# Altium schematic sheet 2-LCD&CAMERA.SchDoc: HD-S16-MB-V1.0
size A3
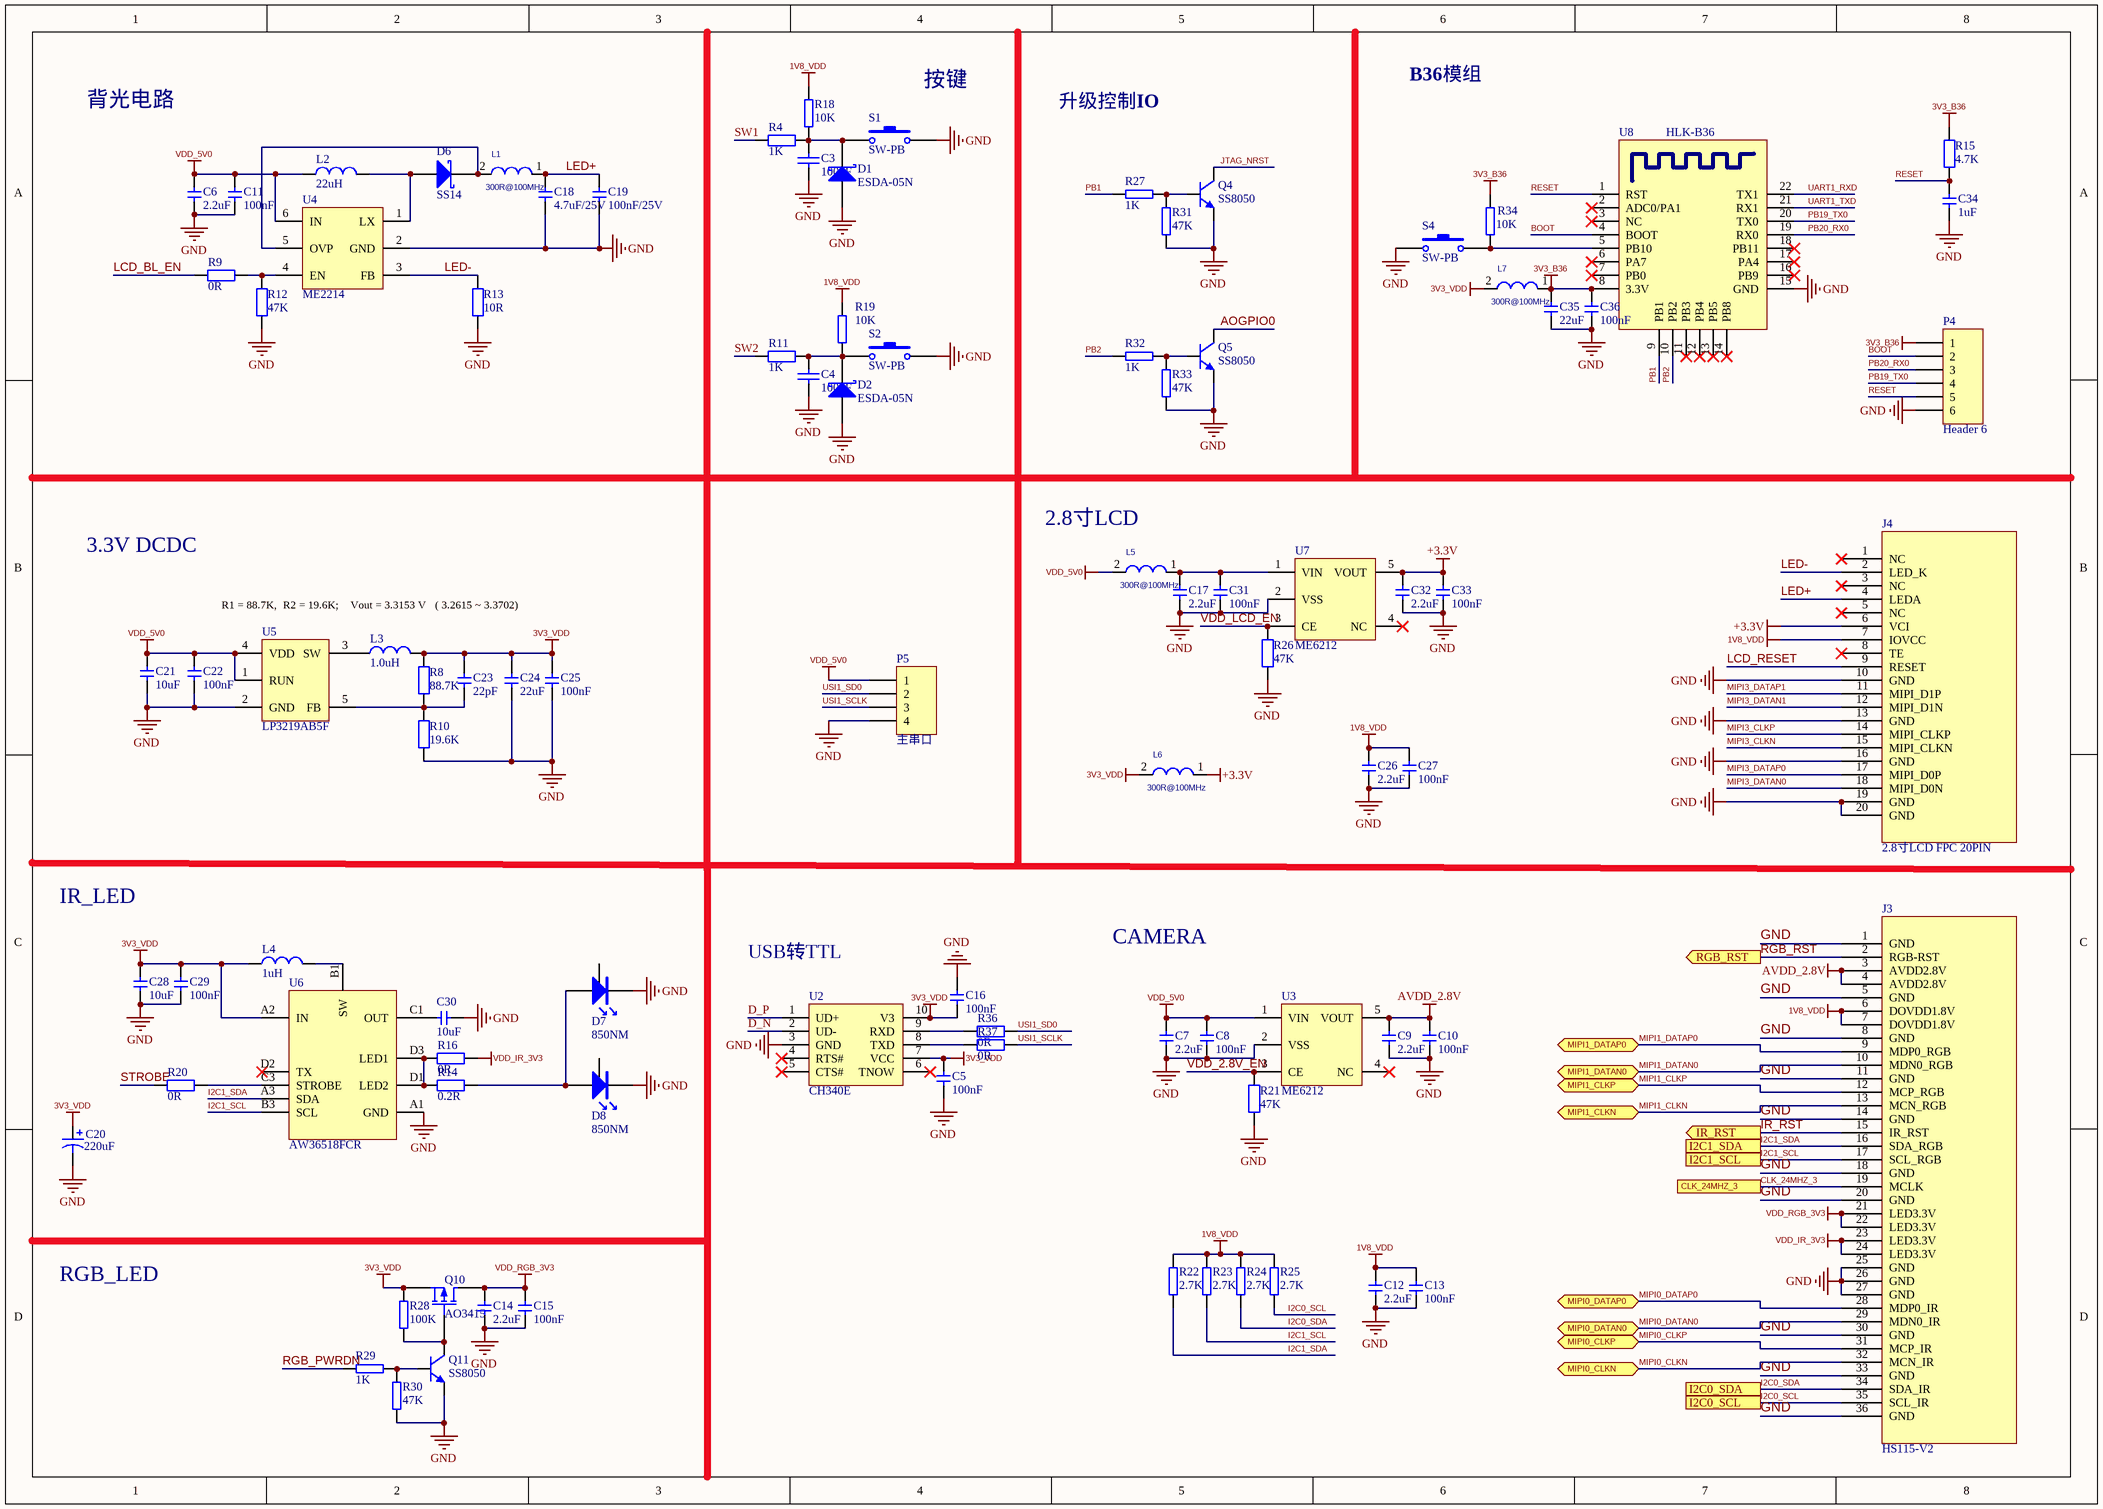
[diagram p0: 2-LCD&CAMERA.SchDoc]

## Parts
C3  100nF  [C0402]
C4  100nF  [C0402]
C5  100nF  [C0402]
C6  2.2uF  [C0402]
C7  2.2uF  [C0402]
C8  100nF  [C0402]
C9  2.2uF  [C0402]
C10  100nF  [C0402]
C11  100nF  [C0402]
C12  2.2uF  [C0402]
C13  100nF  [C0402]
C14  2.2uF  [C0402]
C15  100nF  [C0402]
C16  100nF  [C0402]
C17  2.2uF  [C0402]
C18  4.7uF/25V  [Cap_0603]
C19  100nF/25V  [C0402]
C20  value 220uF  [SMD,6.3x7.7mm]  (hidden comment: Cap Pol1)
C21  10uF  [Cap_0603]
C22  100nF  [C0402]
C23  22pF  [C0402]
C24  22uF  [CAP_0603]
C25  100nF  [C0402]
C26  2.2uF  [C0402]
C27  100nF  [C0402]
C28  10uF  [C0402]
C29  100nF  [C0402]
C30  10uF  [C0402]
C31  100nF  [C0402]
C32  2.2uF  [C0402]
C33  100nF  [C0402]
C34  1uF  [C0402]
C35  22uF  [CAP_0603]
C36  100nF  [C0402]
D1  ESDA-05N  [R0402]
D2  ESDA-05N  [R0402]
D6  SS14  [SOD-123F]
D7  850NM  [LED-3535-850MM]
D8  850NM  [LED-3535-850MM]
J3  HS115-V2  [0.5-36PIN]
J4  2.8寸LCD FPC 20PIN  [0.5-20PIN-抽屉上接]
L1  300R@100MHz  [Res_0603]
L2  22uH  [L3*3]
L3  1.0uH  [L2.5x2.0x1.0mm]
L4  1uH  [L2.5x2.0x1.0mm]
L5  300R@100MHz  [Res_0603]
L6  300R@100MHz  [Res_0603]
L7  300R@100MHz  [Res_0603]
P4  Header 6  [HDR1X6]
P5  主串口  [4P_2.5MM]
Q4  SS8050  [SOT23-BEC]
Q5  SS8050  [SOT23-BEC]
Q10  AO3415  [SOT-23]
Q11  SS8050  [SOT23-BEC]
R4  1K  [R0402]
R8  88.7K  [R0402]
R9  0R  [R0402]
R10  19.6K  [R0402]
R11  1K  [R0402]
R12  47K  [R0402]
R13  10R  [R0805]
R14  0.2R  [R0805]
R15  4.7K  [R0402]
R16  0R  [R0805]
R18  10K  [R0402]
R19  10K  [R0402]
R20  0R  [R0402]
R21  47K  [R0402]
R22  2.7K  [R0402]
R23  2.7K  [R0402]
R24  2.7K  [R0402]
R25  2.7K  [R0402]
R26  47K  [R0402]
R27  1K  [R0402]
R28  100K  [R0402]
R29  1K  [R0402]
R30  47K  [R0402]
R31  47K  [R0402]
R32  1K  [R0402]
R33  47K  [R0402]
R34  10K  [R0402]
R36  0R  [R0402]
R37  0R  [R0402]
S1  SW-PB  [轻触开关4.5x4.5]
S2  SW-PB  [轻触开关4.5x4.5]
S4  SW-PB  [轻触开关4.5x4.5]
U2  CH340E  [MSOP-10]
U3  ME6212  [SOT23-5]
U4  ME2214  [SOT26]
U5  LP3219AB5F  [SOT23-5]
U6  AW36518FCR  [FCQFN-10L]
U7  ME6212  [SOT23-5]
U8  HLK-B36  [HLK-B36]

## Ports
CLK_24MHZ_3, I2C0_SCL, I2C0_SDA, I2C1_SCL, I2C1_SDA, IR_RST (out), MIPI0_CLKN (bidir), MIPI0_CLKP (bidir), MIPI0_DATAN0 (bidir), MIPI0_DATAP0 (bidir), MIPI1_CLKN (bidir), MIPI1_CLKP (bidir), MIPI1_DATAN0 (bidir), MIPI1_DATAP0 (bidir), RGB_RST (out)

## Nets
1V8_VDD: C12.1 C13.1 C26.1 C27.1 J3.6(DOVDD1.8V) J3.7(DOVDD1.8V) J4.7(IOVCC) R18.2 R19.2 R22.1 R23.1 R24.1 R25.1
3V3_B36: C35.1 C36.1 L7.1 P4.1 R15.1 R34.2 U8.8(3.3V)
3V3_VDD: C5.2 C16.1 C20.1 C23.2 C24.1 C25.1 C28.1 C29.1 L3.2 L4.1 L6.2 L7.2 Q10.2(S) R8.2 R28.2 U2.7(VCC) U2.10(V3) U6.A2(IN)
+3.3V: C32.1 C33.1 J4.6(VCI) L6.1 U7.5(VOUT)
AVDD_2.8V: C9.1 C10.1 J3.3(AVDD2.8V) J3.4(AVDD2.8V) U3.5(VOUT)
GND: C3.2 C4.2 C5.1 C6.2 C7.2 C8.2 C9.2 C10.2 C11.2 C12.2 C13.2 C14.2 C15.2 C16.2 C17.2 C18.2 C19.2 C20.2 C21.2 C22.2 C24.2 C25.2 C26.2 C27.2 C28.2 C29.2 C30.2 C31.2 C32.2 C33.2 C34.2 C35.2 C36.2 D1.1(A) D2.1(A) D7.K D8.K J3.1(GND) J3.5(GND) J3.8(GND) J3.11(GND) J3.14(GND) J3.18(GND) J3.20(GND) J3.25(GND) J3.26(GND) J3.27(GND) J3.30(GND) J3.33(GND) J3.36(GND) J4.10(GND) J4.13(GND) J4.16(GND) J4.19(GND) J4.20(GND) P4.6 P5.4 Q4.E Q5.E Q11.E R10.2 R12.1 R13.2 R21.1 R26.1 R30.2 R31.2 R33.2 S1.2 S2.2 S4.1 U2.3(GND) U3.2(VSS) U4.2(GND) U5.2(GND) U6.A1(GND) U7.2(VSS) U8.15(GND)
VDD_5V0: C6.1 C7.1 C8.1 C11.1 C21.1 C22.1 L2.1 L5.2 P5.1 U3.1(VIN) U4.6(IN) U5.1(RUN) U5.4(VDD)
VDD_IR_3V3: J3.23(LED3.3V) J3.24(LED3.3V) R16.2
VDD_RGB_3V3: C14.1 C15.1 J3.21(LED3.3V) J3.22(LED3.3V) Q10.3(D)
AOGPIO0: Q5.C
BOOT: P4.2 U8.4(BOOT)
CLK_24MHZ_3: J3.19(MCLK) ; port CLK_24MHZ_3
D_N: U2.2(UD-)
D_P: U2.1(UD+)
I2C0_SCL: J3.35(SCL_IR) R25.2 ; port I2C0_SCL
I2C0_SDA: J3.34(SDA_IR) R24.2 ; port I2C0_SDA
I2C1_SCL: J3.17(SCL_RGB) R23.2 U6.B3(SCL) ; port I2C1_SCL
I2C1_SDA: J3.16(SDA_RGB) R22.2 U6.A3(SDA) ; port I2C1_SDA
IR_RST: J3.15(IR_RST) ; port IR_RST
JTAG_NRST: Q4.C
LCD_BL_EN: R9.1
LCD_RESET: J4.9(RESET)
LED+: C18.1 C19.1 J4.4(LEDA) L1.1
LED-: J4.2(LED_K) R13.1 U4.3(FB)
MIPI0_CLKN: J3.32(MCN_IR) ; port MIPI0_CLKN
MIPI0_CLKP: J3.31(MCP_IR) ; port MIPI0_CLKP
MIPI0_DATAN0: J3.29(MDN0_IR) ; port MIPI0_DATAN0
MIPI0_DATAP0: J3.28(MDP0_IR) ; port MIPI0_DATAP0
MIPI1_CLKN: J3.13(MCN_RGB) ; port MIPI1_CLKN
MIPI1_CLKP: J3.12(MCP_RGB) ; port MIPI1_CLKP
MIPI1_DATAN0: J3.10(MDN0_RGB) ; port MIPI1_DATAN0
MIPI1_DATAP0: J3.9(MDP0_RGB) ; port MIPI1_DATAP0
MIPI3_CLKN: J4.15(MIPI_CLKN)
MIPI3_CLKP: J4.14(MIPI_CLKP)
MIPI3_DATAN0: J4.18(MIPI_D0N)
MIPI3_DATAN1: J4.12(MIPI_D1N)
MIPI3_DATAP0: J4.17(MIPI_D0P)
MIPI3_DATAP1: J4.11(MIPI_D1P)
PB1: R27.2 U8.9(PB1)
PB2: R32.2 U8.10(PB2)
PB19_TX0: P4.4 U8.20(TX0)
PB20_RX0: P4.3 U8.19(RX0)
RESET: C34.1 P4.5 R15.2 U8.1(RST)
RGB_PWRDN: R29.2
RGB_RST: J3.2(RGB-RST) ; port RGB_RST
STROBE: R20.1
SW1: R4.1
SW2: R11.1
UART1_RXD: U8.22(TX1)
UART1_TXD: U8.21(RX1)
USI1_SCLK: P5.3 R37.1
USI1_SD0: P5.2 R36.1
VDD_2.8V_EN: R21.2 U3.3(CE)
VDD_LCD_EN: R26.2 U7.3(CE)
NetC3_1: C3.1 D1.2(K) R4.2 R18.1 S1.1
NetC4_1: C4.1 D2.2(K) R11.2 R19.1 S2.1
NetC17_1: C17.1 C31.1 L5.1 U7.1(VIN)
NetC23_1: C23.1 R8.1 R10.1 U5.5(FB)
NetC30_1: C30.1 U6.C1(OUT)
NetD6_1: D6.1(A) L2.2 U4.1(LX)
NetD6_2: D6.2(K) L1.2 U4.5(OVP)
NetD7_A: D7.A D8.A R14.2
NetL3_1: L3.1 U5.3(SW)
NetL4_2: L4.2 U6.B1(SW)
NetQ4_B: Q4.B R27.1 R31.1
NetQ5_B: Q5.B R32.1 R33.1
NetQ10_1: Q10.1(G) Q11.C R28.1
NetQ11_B: Q11.B R29.1 R30.1
NetR9_2: R9.2 R12.2 U4.4(EN)
NetR14_1: R14.1 R16.1 U6.D1(LED2) U6.D3(LED1)
NetR20_2: R20.2 U6.C3(STROBE)
NetR34_1: R34.1 S4.2 U8.5(PB10)
NetR36_2: R36.2 U2.9(RXD)
NetR37_2: R37.2 U2.8(TXD)

Not connected (* = marked no-connect by the designer): D7 0; D8 0; J4 1(NC)* 3(NC)* 5(NC)* 8(TE)*; U2 4(RTS#)* 5(CTS#)* 6(TNOW)*; U3 4(NC)*; U6 D2(TX)*; U7 4(NC)*; U8 2(ADC0/PA1)* 3(NC)* 6(PA7)* 7(PB0)* 11(PB3)* 12(PB4)* 13(PB5)* 14(PB8)* 16(PB9)* 17(PA4)* 18(PB11)*

## Notes on the sheet
- 背光电路
- (near S1) 按键
- 升级控制IO
- B36模组
- 3.3V DCDC
- (near L5) 2.8寸LCD
- R1 = 88.7K,  R2 = 19.6K;    Vout = 3.3153 V   ( 3.2615 ~ 3.3702)
- IR_LED
- USB转TTL
- CAMERA
- RGB_LED
- Title
- Size:
- Date:
- A3
- Number:
- Time:
- Revision:
- Sheet
- of
- File:

## Library data of the parts
C3 C4 = Cap: Capacitor; 物料名称: 贴片电容; 物料编码: 3.01.04.0056
C5-C19 C21-C36 = CAP1: C?
C20 = Cap Pol1: Polarized Capacitor (Radial); Published: 8-Jun-2000; LatestRevisionDate: 17-Jul-2002; LatestRevisionNote: Re-released for DXP Platform.; PackageReference: RB7.6-15; Publisher: Altium Limited
D1 D2 D6 = Diode BAS70: Silicon AF Schottky Diode for High-Speed Switching; Note: Pin 2 is not connected and not drawn.; Published: 21-Mar-2003; DatasheetDocument: Oct-1999; PackageDocument: Sep-2001; PackageReference: SOT-23; Publisher: Altium Limited; ComponentLink1Description: Manufacturer Link; ComponentLink1URL: http://www.infineon.com/; ComponentLink2Description: Datasheet; ComponentLink2URL: http://www.infineon.com/upload/Document/cmc_upload/documents/009/382/bas40_bas140series_1.pdf
D7 D8 = LED_IR: 贴片LED，3535，红外850NM
J4 = 2.8寸LCD FPC 20PIN: 1-Lane MIPI
L1 L5-L7 = L/0402
L2-L4 = LineInductors: FootPrint: 0805
P4 = Header 6: Header, 6-Pin; LatestRevisionDate: 17-Jul-2002; LatestRevisionNote: Re-released for DXP Platform.; Publisher: Altium Limited
P5 = Header 4: Header, 4-Pin; LatestRevisionDate: 17-Jul-2002; LatestRevisionNote: Re-released for DXP Platform.; Publisher: Altium Limited
Q4 Q5 Q11 = NPN: 贴片三极管
R4 R8-R16 R20 R21 R26 R36 R37 = Res2: Resistor; Published: 8-Jun-2000; LatestRevisionDate: 17-Jul-2002; LatestRevisionNote: Re-released for DXP Platform.; PackageReference: AXIAL-0.4; Publisher: Altium Limited
  R4 R11: Value: 1K
  R8: Value: 88.7K
  R9 R16 R20 R36 R37: Value: 0R
  R10: Value: 19.6K
  R12 R21 R26: Value: 47K
  R13: Value: 10R
  R14: Value: 0.2R
  R15: Value: 4.7K
R18 R19 R22-R25 R27-R34 = RES1: R?
S1 S2 S4 = SW-PB: Switch; Published: 24-Mar-1999; LatestRevisionDate: 17-Jul-2002; LatestRevisionNote: Re-released for DXP Platform.; PackageReference: SPST-2; Publisher: Altium Limited; PackageDescription: Switch; 2 Leads
U5 = TD6817